# Altium project PCB_Project1.PrjPCB
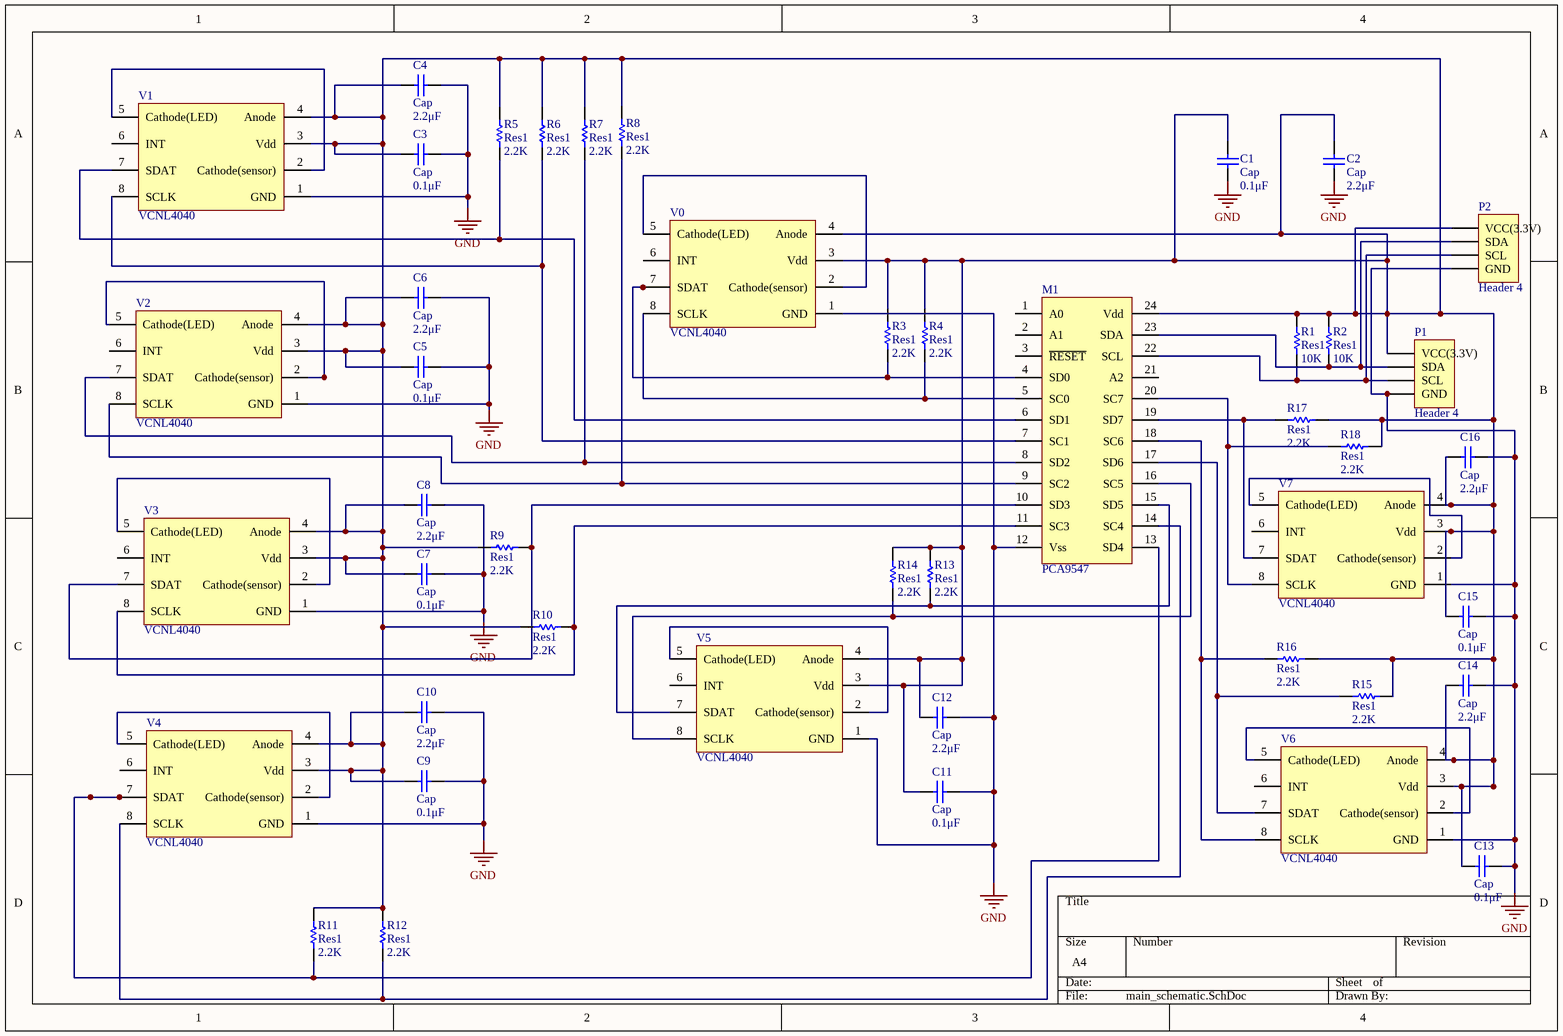
[diagram p0: main_schematic.SchDoc]
1 sheet, 45 parts. Net scope: global (net labels, ports and power ports of the same name join across sheets).
Board file: main_pcb.PcbDoc

## Sheet main_schematic.SchDoc
size A4

### Parts
C1  Cap  value 0.1μF  [1608[0603]]
C2  Cap  value 2.2μF  [1608[0603]]
C3  Cap  value 0.1μF  [1608[0603]]
C4  Cap  value 2.2μF  [1608[0603]]
C5  Cap  value 0.1μF  [1608[0603]]
C6  Cap  value 2.2μF  [1608[0603]]
C7  Cap  value 0.1μF  [1608[0603]]
C8  Cap  value 2.2μF  [1608[0603]]
C9  Cap  value 0.1μF  [1608[0603]]
C10  Cap  value 2.2μF  [1608[0603]]
C11  Cap  value 0.1μF  [1608[0603]]
C12  Cap  value 2.2μF  [1608[0603]]
C13  Cap  value 0.1μF  [1608[0603]]
C14  Cap  value 2.2μF  [1608[0603]]
C15  Cap  value 0.1μF  [1608[0603]]
C16  Cap  value 2.2μF  [1608[0603]]
M1  PCA9547  [TSSOP24]
P1  Header 4  [HDR1X4]
P2  Header 4  [HDR1X4]
R1  Res1  value 10K  [1608[0603]]
R2  Res1  value 10K  [1608[0603]]
R3  Res1  value 2.2K  [1608[0603]]
R4  Res1  value 2.2K  [1608[0603]]
R5  Res1  value 2.2K  [1608[0603]]
R6  Res1  value 2.2K  [1608[0603]]
R7  Res1  value 2.2K  [1608[0603]]
R8  Res1  value 2.2K  [1608[0603]]
R9  Res1  value 2.2K  [1608[0603]]
R10  Res1  value 2.2K  [1608[0603]]
R11  Res1  value 2.2K  [1608[0603]]
R12  Res1  value 2.2K  [1608[0603]]
R13  Res1  value 2.2K  [1608[0603]]
R14  Res1  value 2.2K  [1608[0603]]
R15  Res1  value 2.2K  [1608[0603]]
R16  Res1  value 2.2K  [1608[0603]]
R17  Res1  value 2.2K  [1608[0603]]
R18  Res1  value 2.2K  [1608[0603]]
V0  VCNL4040  [SOP8]
V1  VCNL4040  [SOP8]
V2  VCNL4040  [SOP8]
V3  VCNL4040  [SOP8]
V4  VCNL4040  [SOP8]
V5  VCNL4040  [SOP8]
V6  VCNL4040  [SOP8]
V7  VCNL4040  [SOP8]

### Nets
GND: C1.1 C2.1 C3.1 C4.1 C5.1 C6.1 C7.1 C8.1 C9.1 C10.1 C11.1 C12.1 C13.1 C14.1 C15.1 C16.1 M1.12(Vss) P1.4(GND) P2.4(GND) V0.1(GND) V1.1(GND) V2.1(GND) V3.1(GND) V4.1(GND) V5.1(GND) V6.1(GND) V7.1(GND)
NetC1_2: C1.2 C2.2 C3.2 C4.2 C5.2 C6.2 C7.2 C8.2 C9.2 C10.2 C11.2 C12.2 C13.2 C14.2 C15.2 C16.2 M1.24(Vdd) P1.1(VCC(3.3V)) P2.1(VCC(3.3V)) R1.2 R2.2 R3.2 R4.2 R5.2 R6.2 R7.2 R8.2 R9.2 R10.2 R11.1 R12.1 R13.2 R14.2 R15.1 R16.1 R17.1 R18.1 V0.3(Vdd) V0.4(Anode) V1.3(Vdd) V1.4(Anode) V2.3(Vdd) V2.4(Anode) V3.3(Vdd) V3.4(Anode) V4.3(Vdd) V4.4(Anode) V5.3(Vdd) V5.4(Anode) V6.3(Vdd) V6.4(Anode) V7.3(Vdd) V7.4(Anode)
NetM1_4: M1.4(SD0) R3.1 V0.7(SDAT)
NetM1_5: M1.5(SC0) R4.1 V0.8(SCLK)
NetM1_6: M1.6(SD1) R5.1 V1.7(SDAT)
NetM1_7: M1.7(SC1) R6.1 V1.8(SCLK)
NetM1_8: M1.8(SD2) R7.1 V2.7(SDAT)
NetM1_9: M1.9(SC2) R8.1 V2.8(SCLK)
NetM1_10: M1.10(SD3) R9.1 V3.7(SDAT)
NetM1_11: M1.11(SC3) R10.1 V3.8(SCLK)
NetM1_13: M1.13(SD4) R11.2 V4.7(SDAT)
NetM1_14: M1.14(SC4) R12.2 V4.8(SCLK)
NetM1_15: M1.15(SD5) R13.1 V5.7(SDAT)
NetM1_16: M1.16(SC5) R14.1 V5.8(SCLK)
NetM1_17: M1.17(SD6) R15.2 V6.7(SDAT)
NetM1_18: M1.18(SC6) R16.2 V6.8(SCLK)
NetM1_19: M1.19(SD7) R17.2 V7.7(SDAT)
NetM1_20: M1.20(SC7) R18.2 V7.8(SCLK)
NetM1_22: M1.22(SCL) P1.3(SCL) P2.3(SCL) R1.1
NetM1_23: M1.23(SDA) P1.2(SDA) P2.2(SDA) R2.1
NetV0_2: V0.2(Cathode(sensor)) V0.5(Cathode(LED))
NetV1_2: V1.2(Cathode(sensor)) V1.5(Cathode(LED))
NetV2_2: V2.2(Cathode(sensor)) V2.5(Cathode(LED))
NetV3_2: V3.2(Cathode(sensor)) V3.5(Cathode(LED))
NetV4_2: V4.2(Cathode(sensor)) V4.5(Cathode(LED))
NetV5_2: V5.2(Cathode(sensor)) V5.5(Cathode(LED))
NetV6_2: V6.2(Cathode(sensor)) V6.5(Cathode(LED))
NetV7_2: V7.2(Cathode(sensor)) V7.5(Cathode(LED))

Not connected (* = marked no-connect by the designer): M1 1(A0) 2(A1) 3(~{RESET}) 21(A2); V0 6(INT); V1 6(INT); V2 6(INT); V3 6(INT); V4 6(INT); V5 6(INT); V6 6(INT); V7 6(INT)

### Library data of the parts
C1-C16 = Cap: Capacitor; Published: 8-Jun-2000; LatestRevisionDate: 17-Jul-2002; LatestRevisionNote: Re-released for DXP Platform.; PackageReference: RAD-0.3; Publisher: Altium Limited; PackageDescription: Radial Cap, Thru-Hole; 2 Leads; 0.3 in Pin Spacing
P1 P2 = Header 4: Header, 4-Pin; LatestRevisionDate: 17-Jul-2002; LatestRevisionNote: Re-released for DXP Platform.; Publisher: Altium Limited
R1-R18 = Res1: Resistor; Published: 8-Jun-2000; LatestRevisionDate: 17-Jul-2002; LatestRevisionNote: Re-released for DXP Platform.; PackageReference: AXIAL-0.3; Publisher: Altium Limited; PackageDescription: Axial Device, Thru-Hole; 2 Leads; 0.3 in Pin Spacing
V0-V7 = Component_1